# EAGLE design FaBo_KeyBoard_Sample_cursor_Rev100000 (EAGLE 9.6.2)
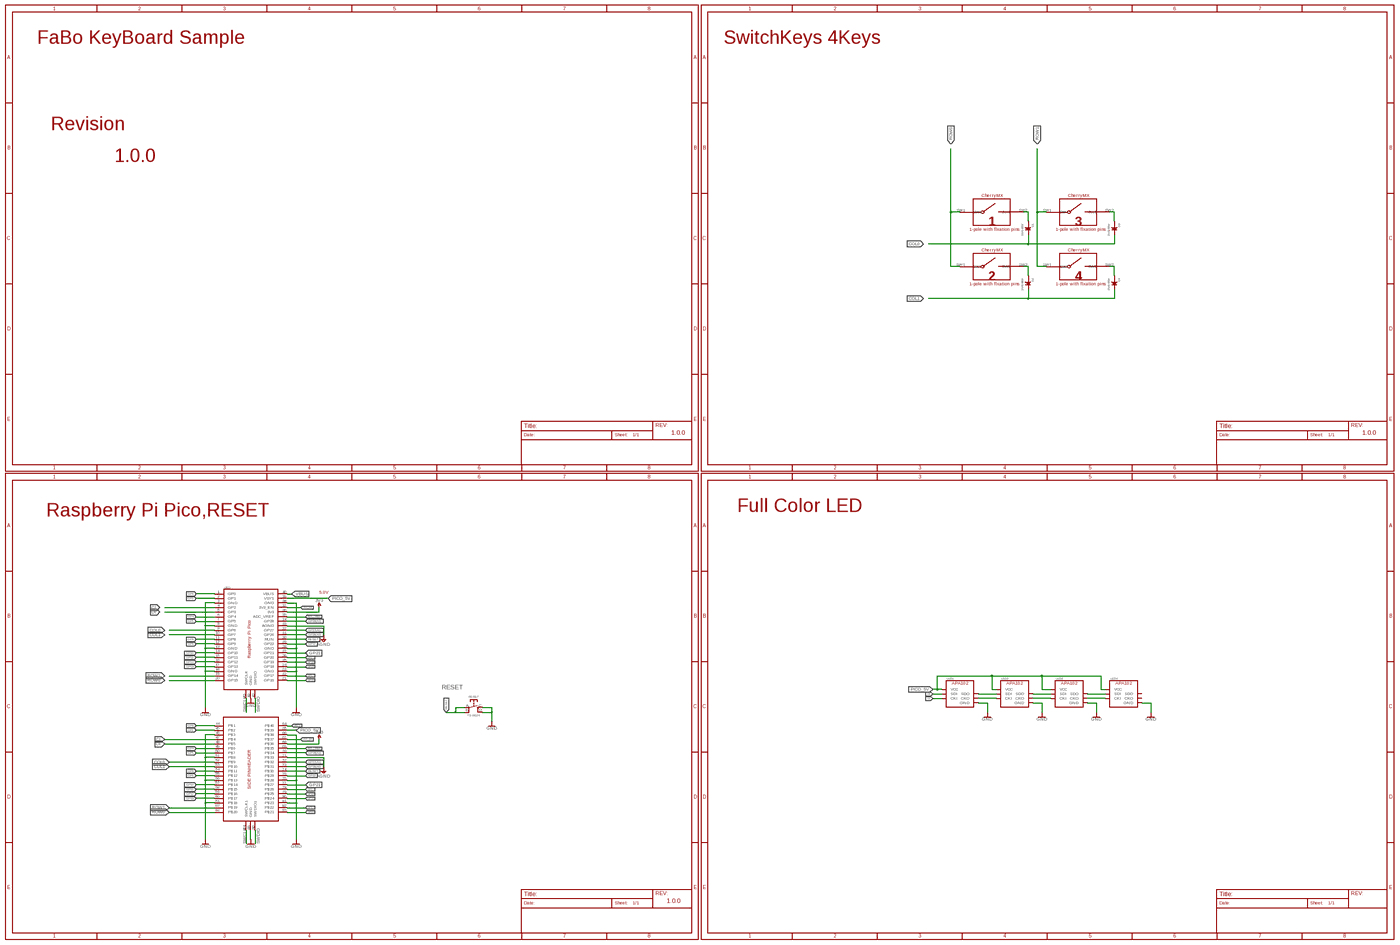
[diagram p0: schematic, sheet 1, overview]
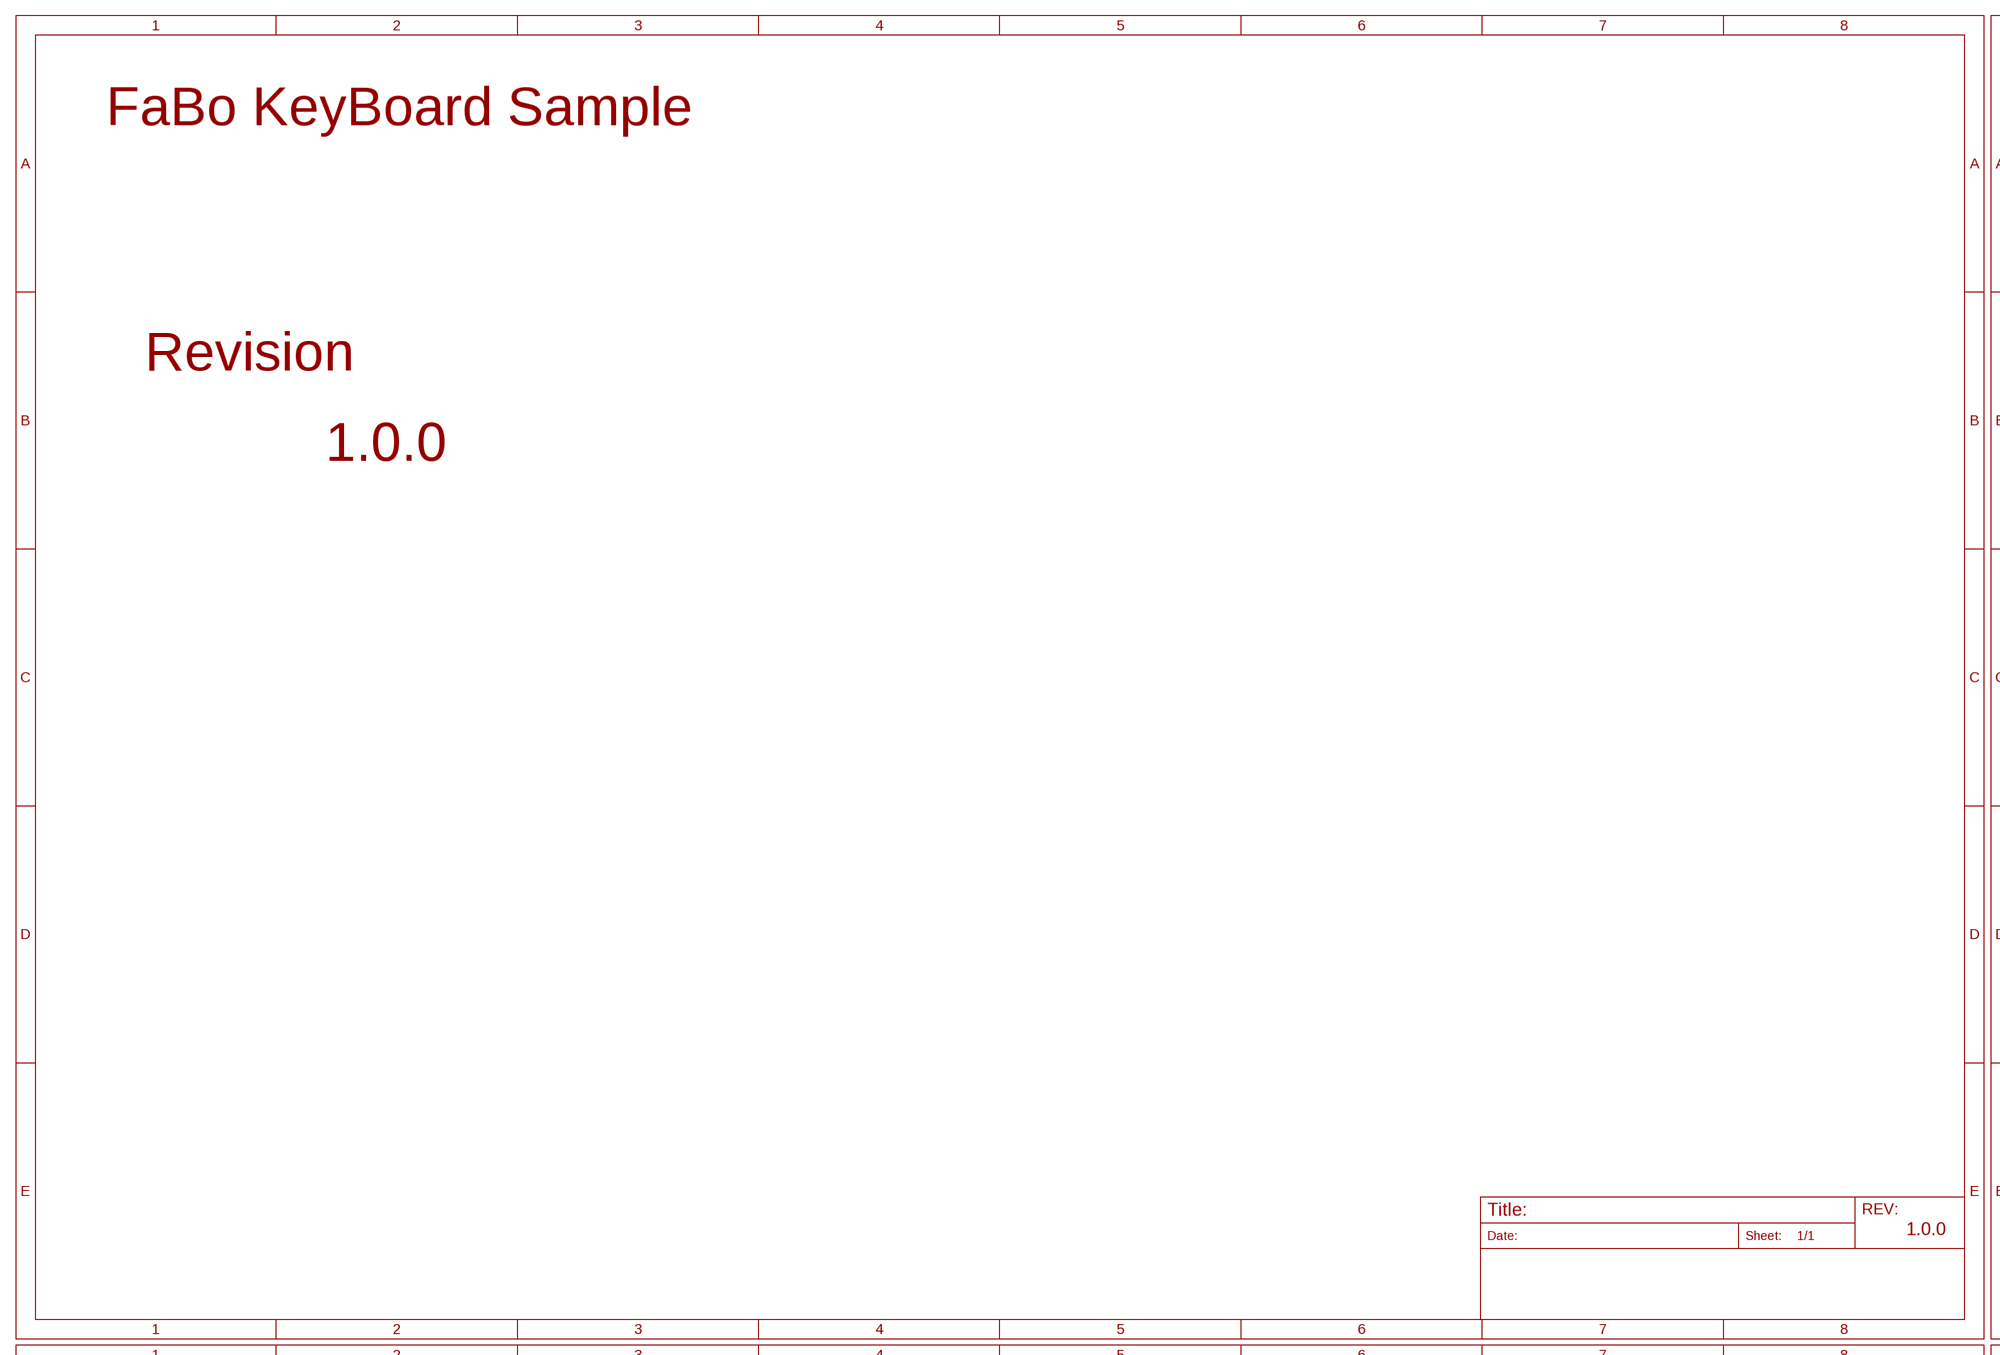
[diagram p1: schematic, sheet 1, part 1 of 4]
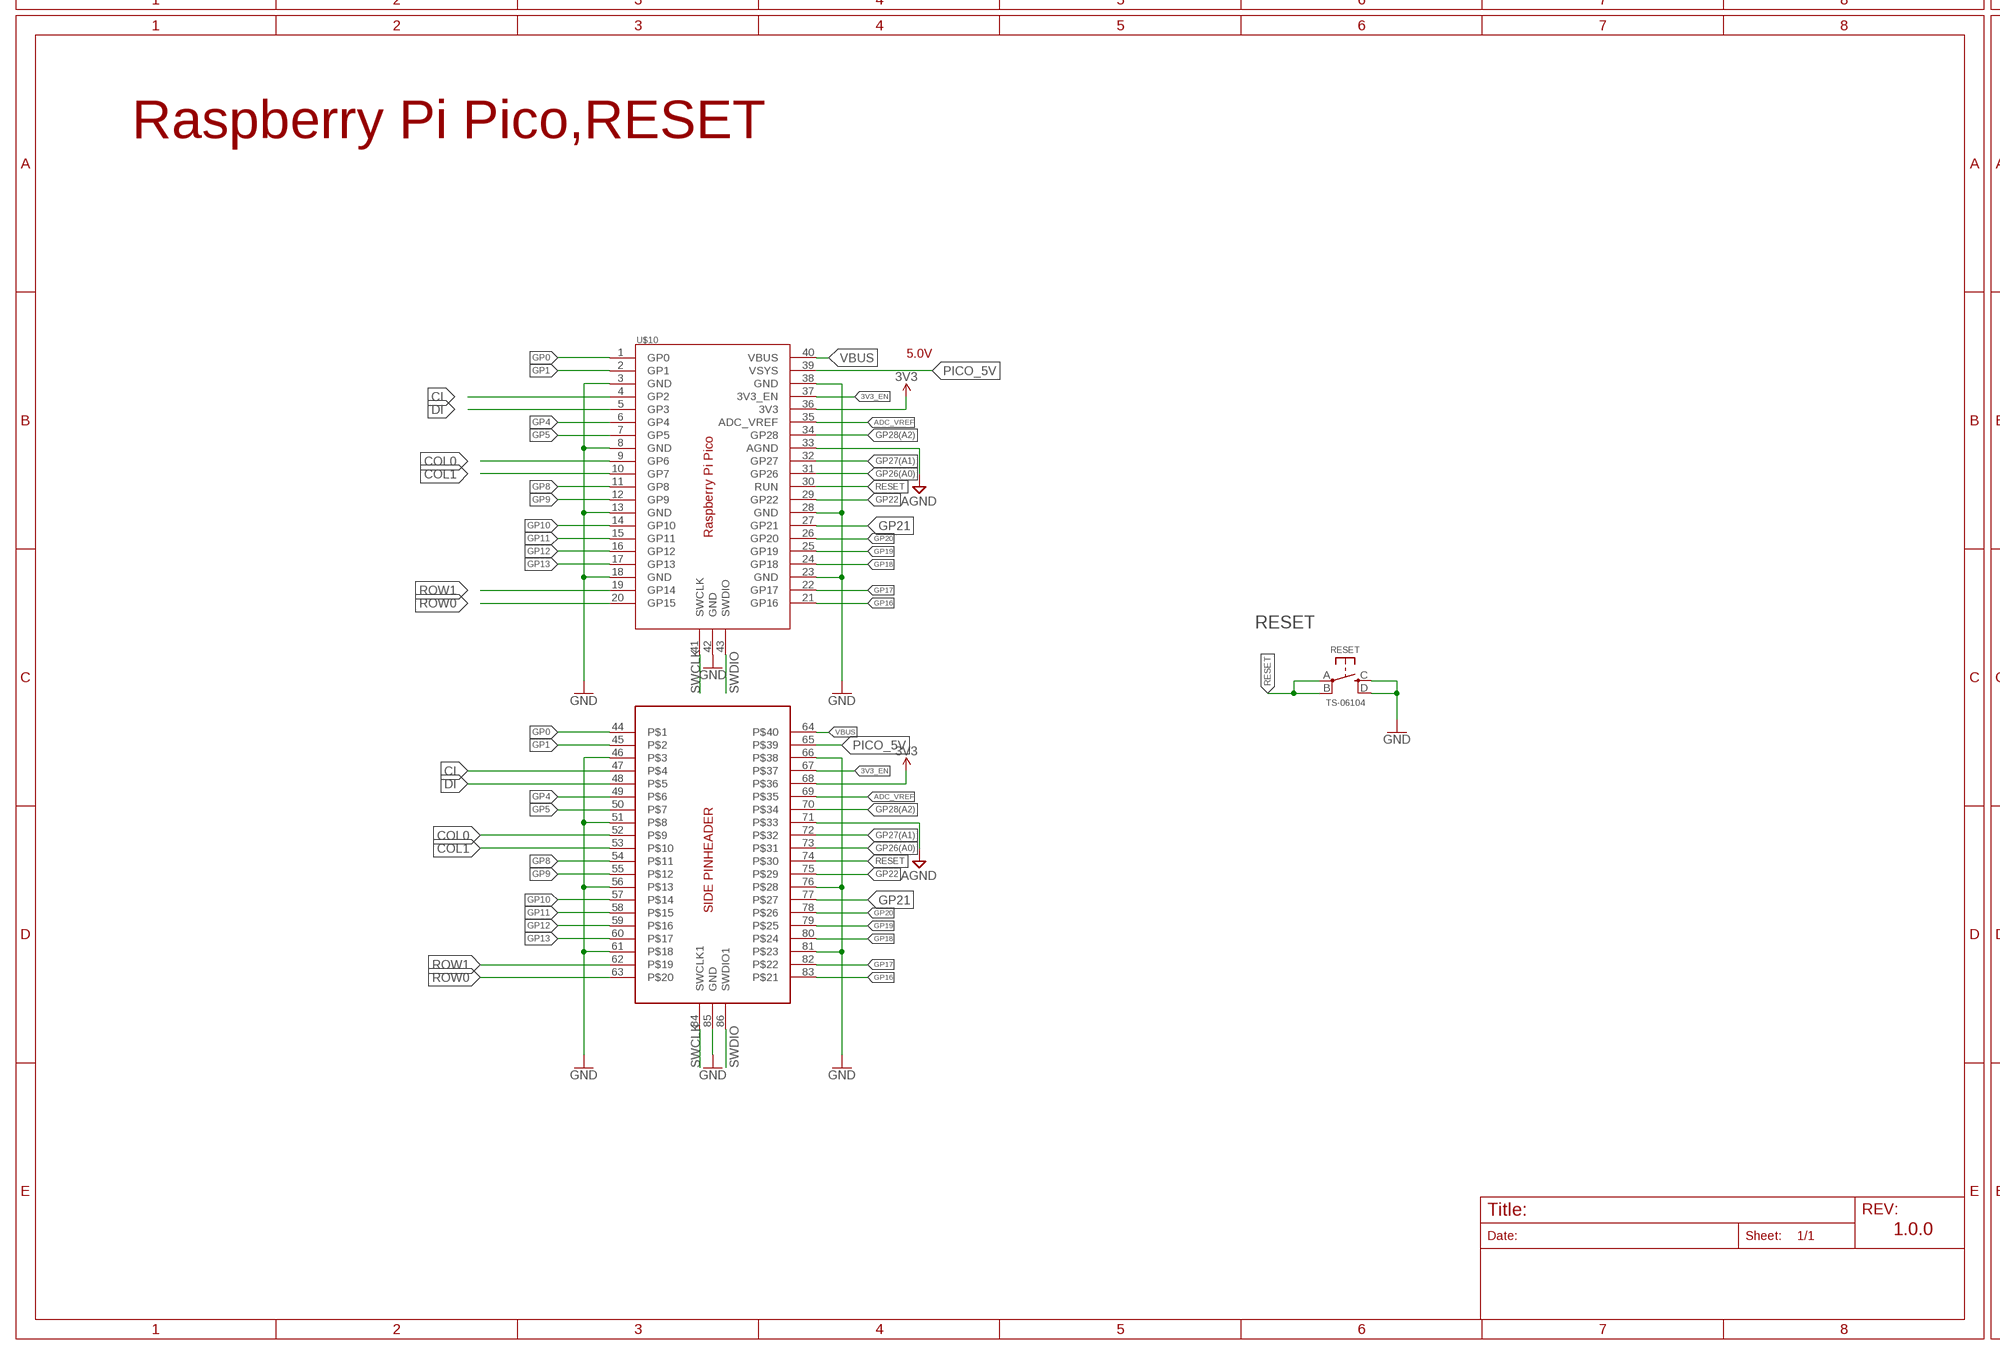
[diagram p2: schematic, sheet 1, part 2 of 4]
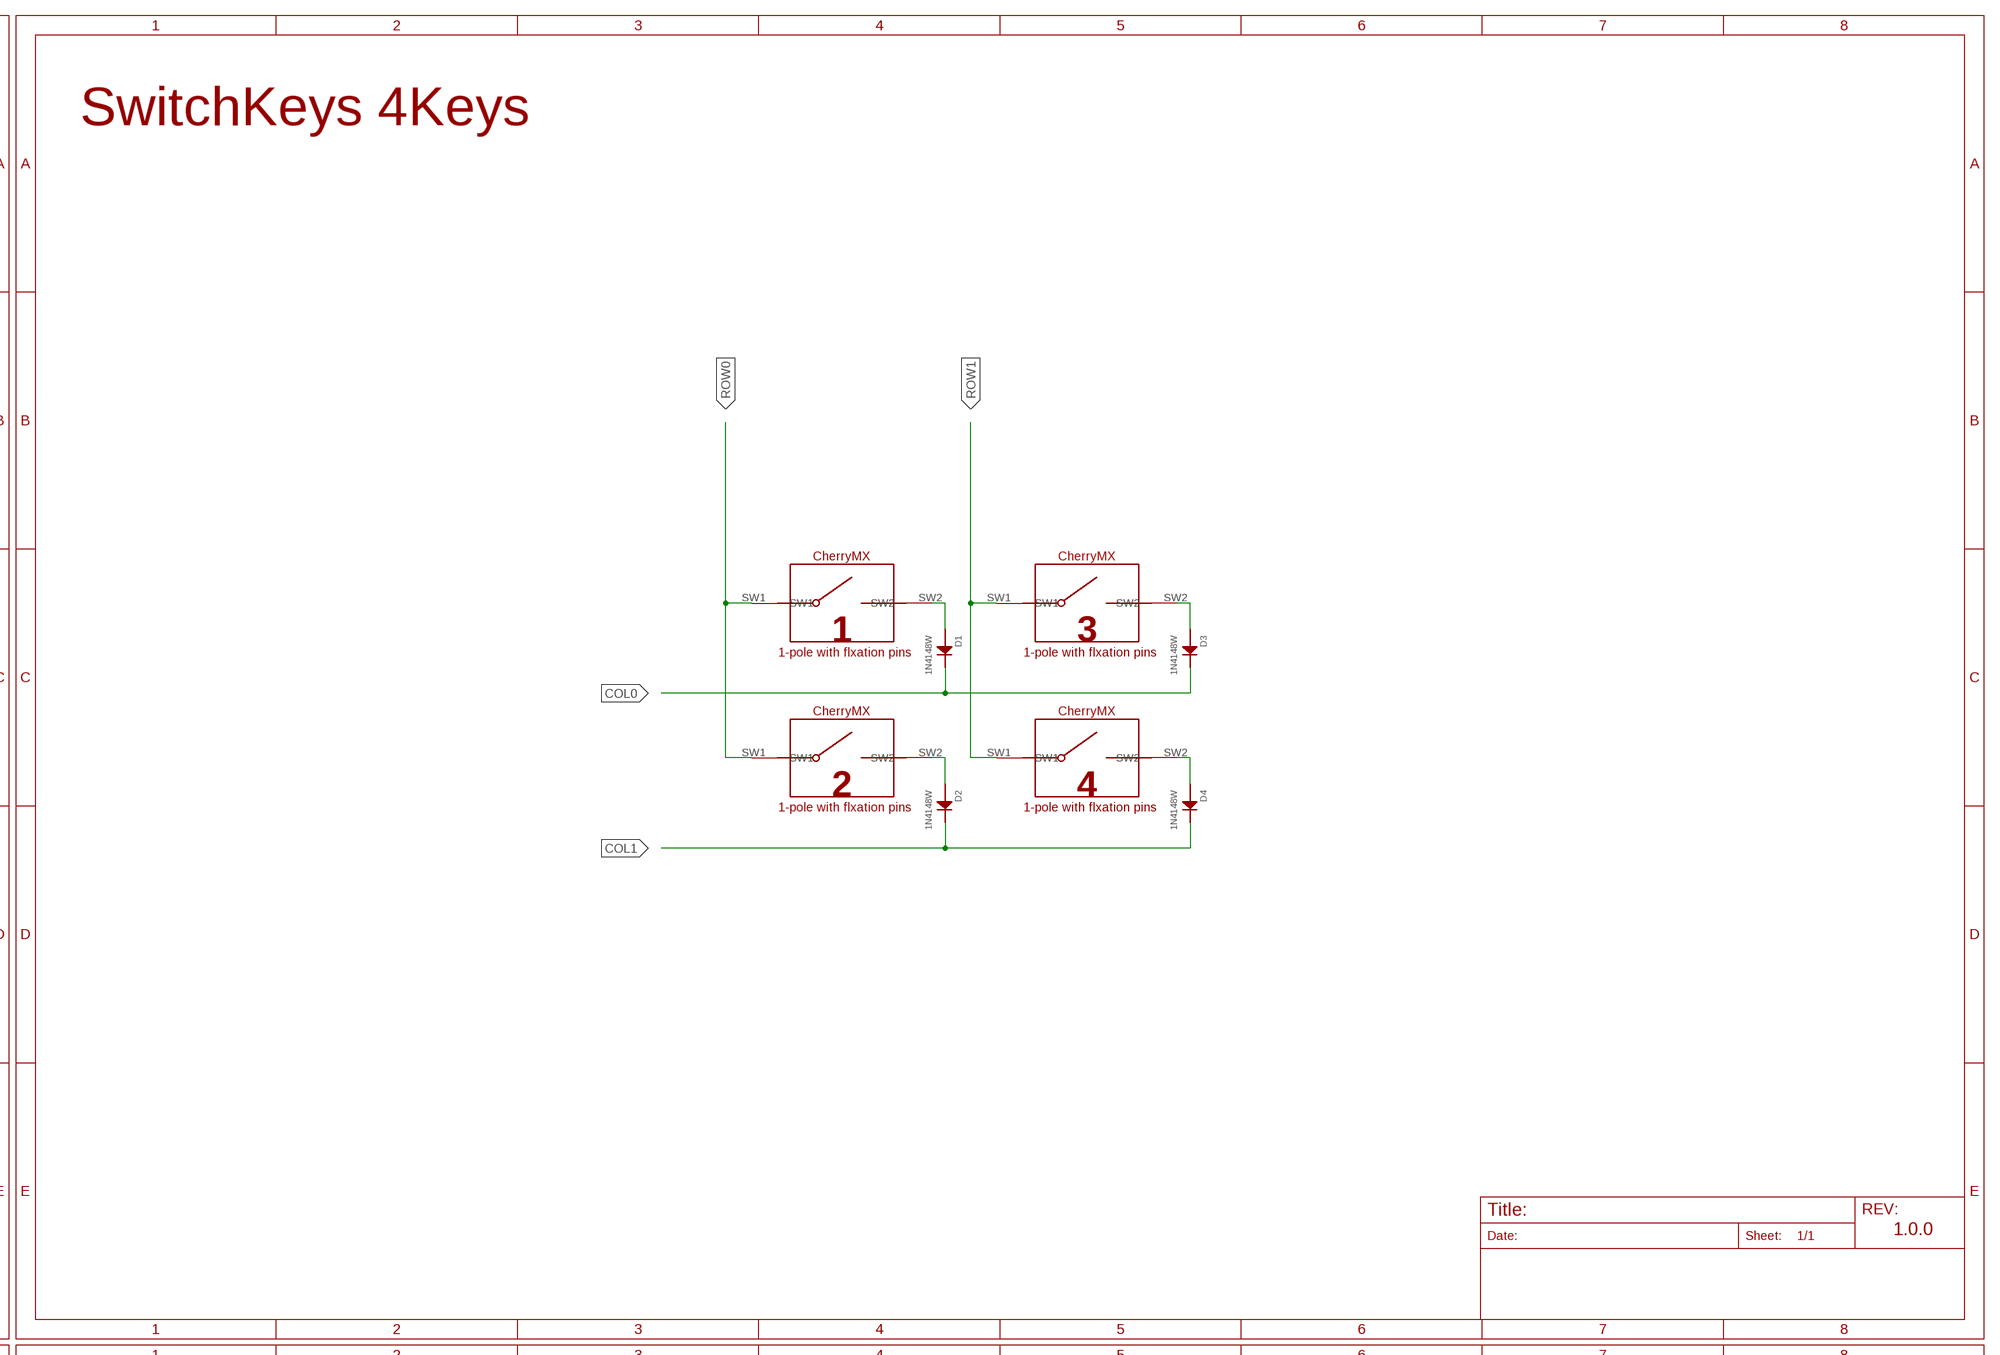
[diagram p3: schematic, sheet 1, part 3 of 4]
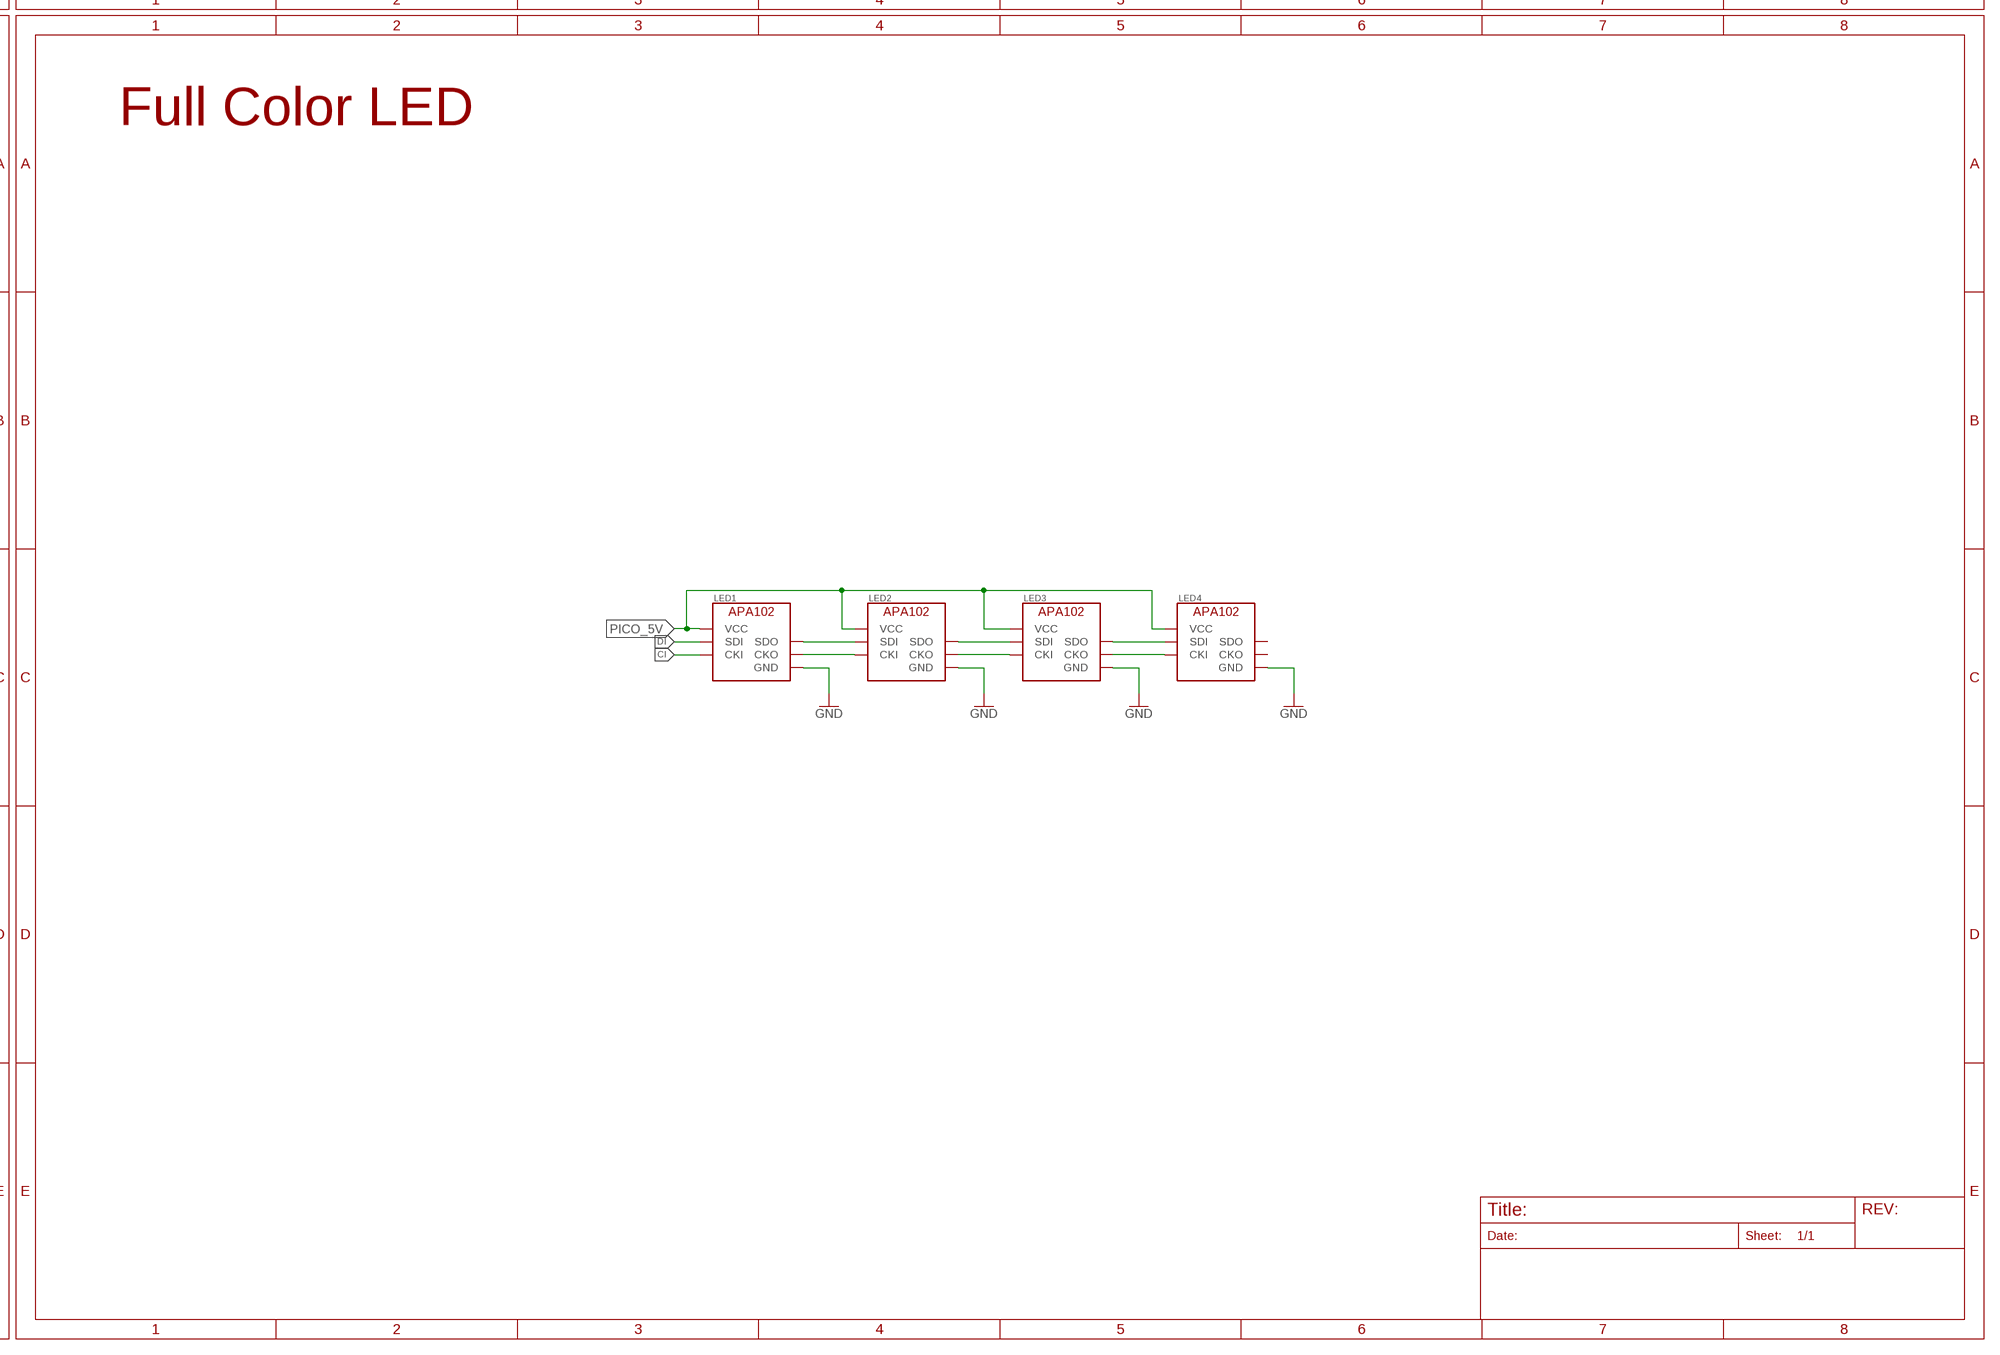
[diagram p4: schematic, sheet 1, part 4 of 4]

## Parts
D1  1N4148W  [SOD-123]
D2  1N4148W  [SOD-123]
D3  1N4148W  [SOD-123]
D4  1N4148W  [SOD-123]
LED1  APA102_IPIXEL  [APA102_2020]
LED2  APA102_IPIXEL  [APA102_2020]
LED3  APA102_IPIXEL  [APA102_2020]
LED4  APA102_IPIXEL  [APA102_2020]
RESET  TS-06104  [TS-06104]
SW1  CHERRYMX_1-POLE_FLXATION_PINS  [CHERRYMX_1-POLE_FLXATION_PINS]
SW2  CHERRYMX_1-POLE_FLXATION_PINS  [CHERRYMX_1-POLE_FLXATION_PINS]
SW3  CHERRYMX_1-POLE_FLXATION_PINS  [CHERRYMX_1-POLE_FLXATION_PINS]
SW4  CHERRYMX_1-POLE_FLXATION_PINS  [CHERRYMX_1-POLE_FLXATION_PINS]
U$10  RASPBERRY_PI_PICO_BOTH_TH_PINHEADER  [RASPBERRY_PI_PICO_HEADER_BOTH]

## Nets
3V3: U$10.36(3V3) U$10.68
3V3_EN: U$10.37(3V3_EN) U$10.67
ADC_VREF: U$10.35(ADC_VREF) U$10.69
AGND: U$10.33(AGND) U$10.71
CI: LED1.CKI U$10.4(GP2) U$10.47
CI1: LED1.CKO LED2.CKI
CI2: LED2.CKO LED3.CKI
CI3: LED3.CKO LED4.CKI
COL0: D1.1(CATHODE) D3.1(CATHODE) U$10.9(GP6) U$10.52
COL1: D2.1(CATHODE) D4.1(CATHODE) U$10.10(GP7) U$10.53
DI: LED1.SDI U$10.5(GP3) U$10.48
DI1: LED1.SDO LED2.SDI
DI2: LED2.SDO LED3.SDI
DI3: LED3.SDO LED4.SDI
GND: LED1.GND LED2.GND LED3.GND LED4.GND RESET.C RESET.D U$10.3(GND) U$10.8(GND) U$10.13(GND) U$10.18(GND) U$10.23(GND) U$10.28(GND) U$10.38(GND) U$10.42(GND) U$10.46 U$10.51 U$10.56 U$10.61 U$10.66 U$10.76 U$10.81 U$10.85(GND)
GP0: U$10.1(GP0) U$10.44
GP1: U$10.2(GP1) U$10.45
GP4: U$10.6(GP4) U$10.49
GP5: U$10.7(GP5) U$10.50
GP8: U$10.11(GP8) U$10.54
GP9: U$10.12(GP9) U$10.55
GP10: U$10.14(GP10) U$10.57
GP11: U$10.15(GP11) U$10.58
GP12: U$10.16(GP12) U$10.59
GP13: U$10.17(GP13) U$10.60
GP16: U$10.21(GP16) U$10.83
GP17: U$10.22(GP17) U$10.82
GP18: U$10.24(GP18) U$10.80
GP19: U$10.25(GP19) U$10.79
GP20: U$10.26(GP20) U$10.78
GP21: U$10.27(GP21) U$10.77
GP22: U$10.29(GP22) U$10.75
GP26(A0): U$10.31(GP26) U$10.73
GP27(A1): U$10.32(GP27) U$10.72
GP28(A2): U$10.34(GP28) U$10.70
N$2: D1.2(ANODE) SW1.SW2
N$3: D2.2(ANODE) SW2.SW2
N$8: D3.2(ANODE) SW3.SW2
N$9: D4.2(ANODE) SW4.SW2
PICO_5V: LED1.VCC LED2.VCC LED3.VCC LED4.VCC U$10.39(VSYS) U$10.65
RESET: RESET.A RESET.B U$10.30(RUN) U$10.74
ROW0: SW1.SW1 SW2.SW1 U$10.20(GP15) U$10.63
ROW1: SW3.SW1 SW4.SW1 U$10.19(GP14) U$10.62
SWCLK: U$10.41(SWCLK) U$10.84(SWCLK1)
SWDIO: U$10.43(SWDIO) U$10.86(SWDIO1)
VBUS: U$10.40(VBUS) U$10.64
Unconnected: LED4.CKO LED4.SDO

## Notes on the sheet
- FaBo KeyBoard Sample | SwitchKeys 4Keys
- Revision
- 1.0.0
- 1 | 3
- 2 | 4
- 1.0.0 | 1.0.0
- Raspberry Pi Pico,RESET | Full Color LED
- 5.0V
- RESET
- 1.0.0

## Library data of the parts
D1-D4 = FaBo-Diode:1N4148W
LED1-LED4 = FaBo-LED:APA102
RESET = FaBo-Switch:TS-06104
SW1-SW4 = FaBo-Keyboard:CHERRYMX_1-POLE_FLXATION_PINS: KeySwitch MX Series
U$10 = FaBo-Boards:RASPBERRY_PI_PICO_BOTH_TH_PINHEADER

## Board
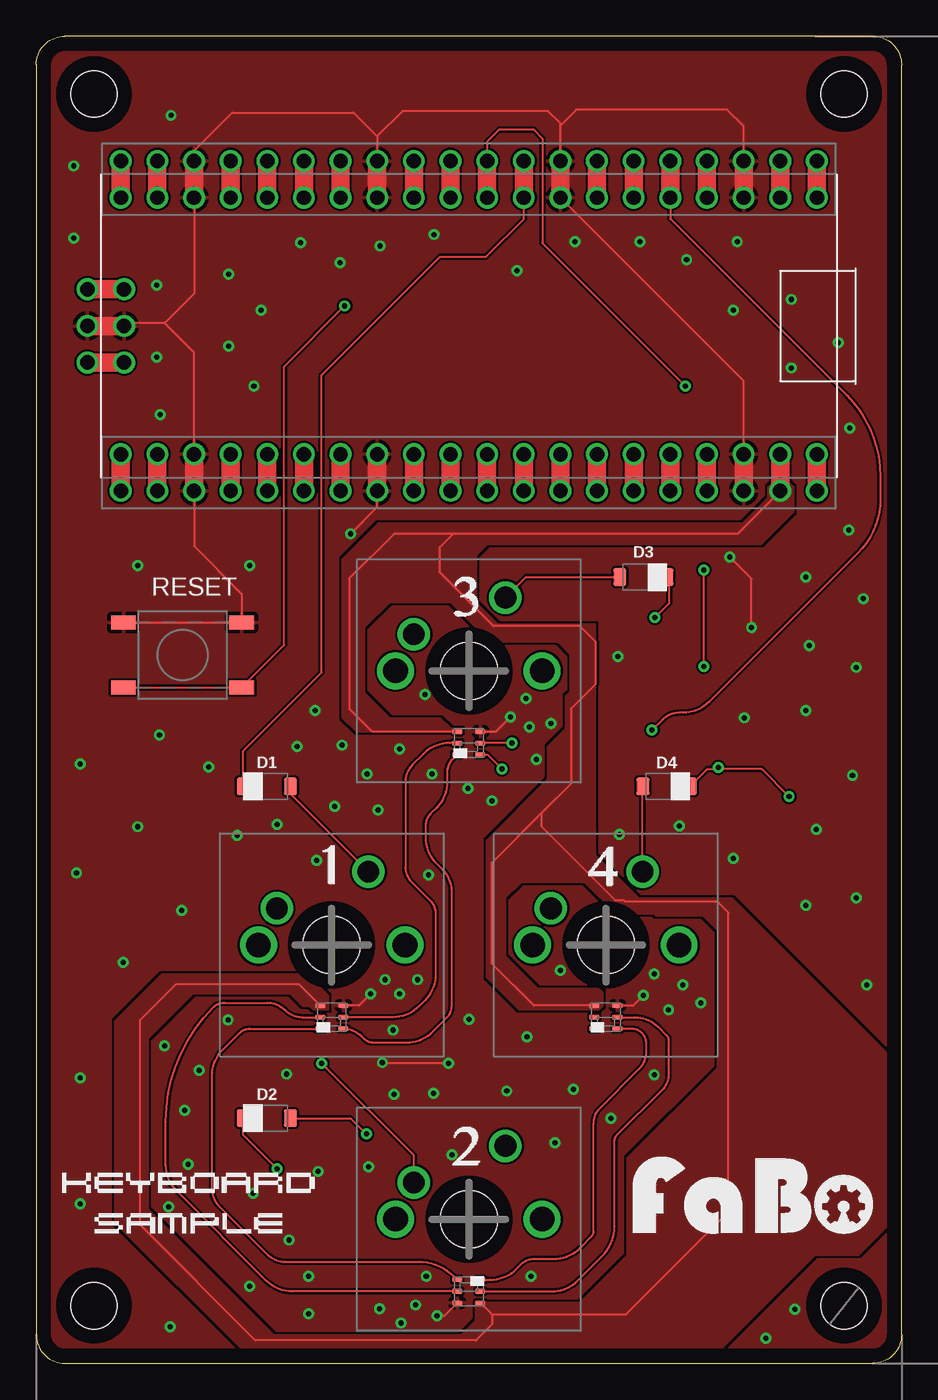
[diagram p5: board, top side]
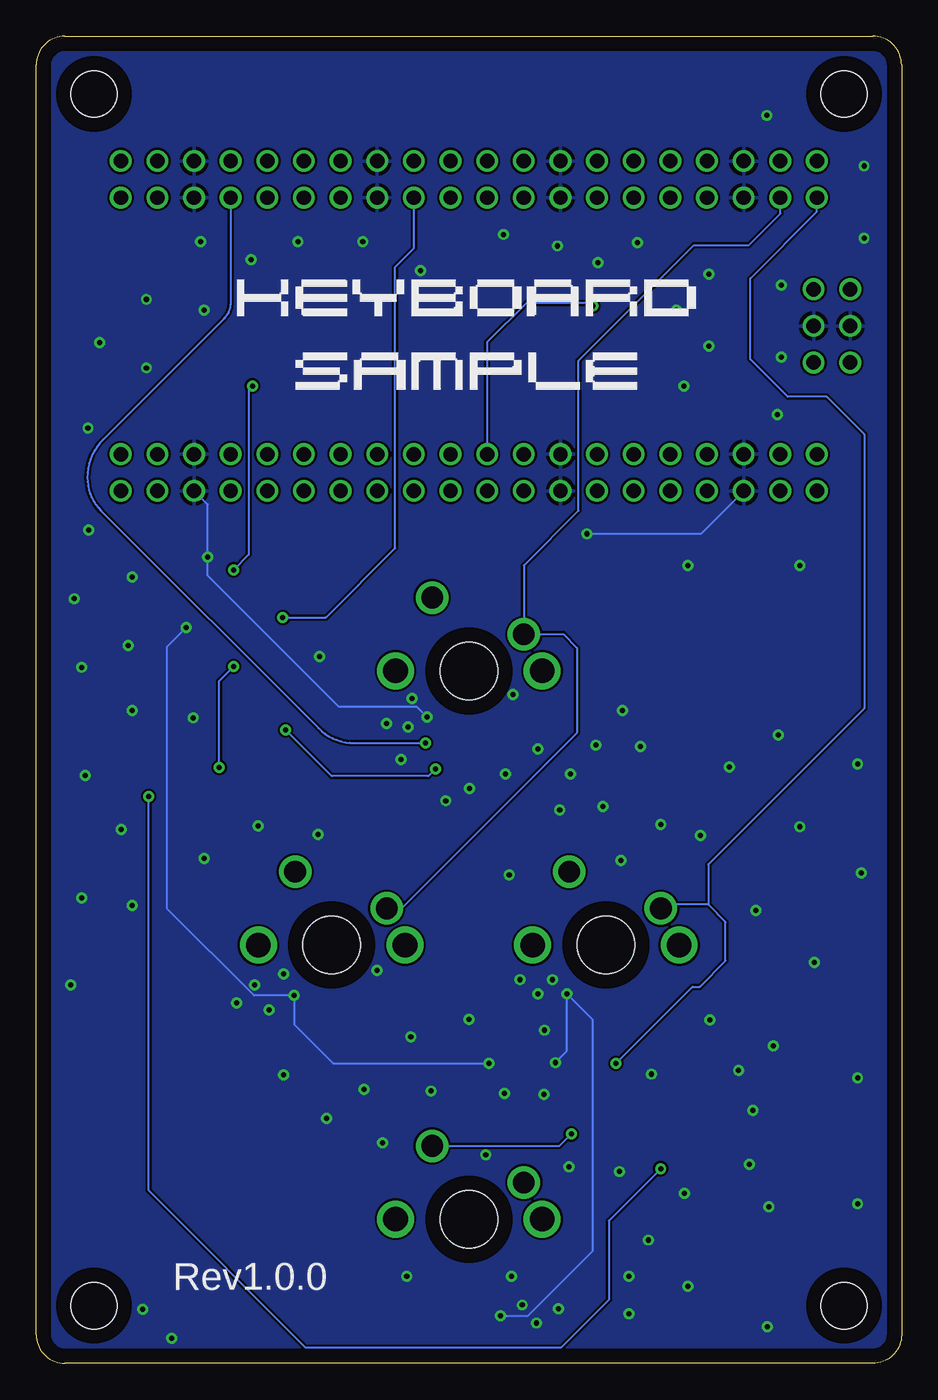
[diagram p6: board, bottom side, seen from below]

Size 60 x 92 mm. Coordinates in mm from the lower left corner, seen from the top.
Outline: 2,0 58,0 arc90 60,2 60,90 arc90 58,92 2,92 arc90 0,90 0,2 arc90 2,0
Copper layers (1*16): Top 0.035mm / dielectric 1.5mm / Bottom 0.035mm
Design rules "default *": minimum track width 6mil, minimum drill 0.35mm, track to track 6mil, track to pad 6mil, pad to pad 6mil, via to via 6mil, smd to smd 6mil, copper to edge 40mil, drill to drill 6mil, minimum pad ring 10mil, minimum via ring 8mil, stop-mask expansion 4mil, vias tented up to drill 0.4mm, thermal gap 10mil
Holes 3.2 mm at 4,4 56,4 4,88 56,88

### Footprints (pad centres in the part's own frame; a part is rotated, then mirrored left to right if it is on the bottom)
SOD-123 = smd 0.91 x 1.22: 1 -1.635,0; 2 1.635,0
APA102_2020 = smd 0.7 x 0.35: CKI 0.8,0; CKO -0.8,0; GND 0.8,0.8; SDI 0.8,-0.8; SDO -0.8,-0.8; VCC -0.8,0.8
TS-06104 = smd 1.8 x 1: A 4.1,2.25; B -4.1,2.25; C 4.1,-2.25; D -4.1,-2.25
CHERRYMX_1-POLE_FLXATION_PINS = drill 1.704: FLXA1 -5.08,0; FLXA2 5.08,0 | drill 1.501: SW1 -3.81,2.54; SW2 2.54,5.08 | hole 3.99: 0,0
RASPBERRY_PI_PICO_HEADER_BOTH = drill 1: 1 -8.89,24.13; 2 -8.89,21.59; 3 -8.89,19.05; 4 -8.89,16.51; 5 -8.89,13.97; 6 -8.89,11.43; 7 -8.89,8.89; 8 -8.89,6.35; 9 -8.89,3.81; 10 -8.89,1.27; 11 -8.89,-1.27; 12 -8.89,-3.81; 13 -8.89,-6.35; 14 -8.89,-8.89; 15 -8.89,-11.43; 16 -8.89,-13.97; 17 -8.89,-16.51; 18 -8.89,-19.05; 19 -8.89,-21.59; 20 -8.89,-24.13; 21 8.89,-24.13; 22 8.89,-21.59; 23 8.89,-19.05; 24 8.89,-16.51; 25 8.89,-13.97; 26 8.89,-11.43; 27 8.89,-8.89; 28 8.89,-6.35; 29 8.89,-3.81; 30 8.89,-1.27; 31 8.89,1.27; 32 8.89,3.81; 33 8.89,6.35; 34 8.89,8.89; 35 8.89,11.43; 36 8.89,13.97; 37 8.89,16.51; 38 8.89,19.05; 39 8.89,21.59; 40 8.89,24.13; 41 -2.54,-23.9; 42 0,-23.9; 43 2.54,-23.9; 44 -11.43,24.13; 45 -11.43,21.59; 46 -11.43,19.05; 47 -11.43,16.51; 48 -11.43,13.97; 49 -11.43,11.43; 50 -11.43,8.89; 51 -11.43,6.35; 52 -11.43,3.81; 53 -11.43,1.27; 54 -11.43,-1.27; 55 -11.43,-3.81; 56 -11.43,-6.35; 57 -11.43,-8.89; 58 -11.43,-11.43; 59 -11.43,-13.97; 60 -11.43,-16.51; 61 -11.43,-19.05; 62 -11.43,-21.59; 63 -11.43,-24.13; 64 11.43,24.13; 65 11.43,21.59; 66 11.43,19.05; 67 11.43,16.51; 68 11.43,13.97; 69 11.43,11.43; 70 11.43,8.89; 71 11.43,6.35; 72 11.43,3.81; 73 11.43,1.27; 74 11.43,-1.27; 75 11.43,-3.81; 76 11.43,-6.35; 77 11.43,-8.89; 78 11.43,-11.43; 79 11.43,-13.97; 80 11.43,-16.51; 81 11.43,-19.05; 82 11.43,-21.59; 83 11.43,-24.13; 84 -2.54,-26.44; 85 0,-26.44; 86 2.54,-26.44

### Placement (x,y rotation side)
D1  16,40 0 top
D2  16,17 0 top
D3  42.1,54.5 180 top
D4  43.7,40 180 top
LED1  30,43 0 top
LED2  20.5,24 0 top
LED3  30,5 180 top
LED4  39.5,24 0 top
RESET  10.16,49.1 180 top
SW1  20.5,29 0 top
SW2  30,10 0 top
SW3  30,48 0 top
SW4  39.5,29 0 top
U$1  [LOGO_FABO_L]  49,9 0 top
U$10  30,71.91 270 top

### Tracks (layer width: path | path; a pad name or v marks a point on that pad's centre or on a via)
3V3
  Top 1.27: U$10.68 U$10.36
3V3_EN
  Top 1.27: U$10.67 U$10.37
ADC_VREF
  Top 1.27: U$10.69 U$10.35
AGND
  Top 1.27: U$10.71 U$10.33
CI  (via drill 0.35)
  Top 0.152: v33,43 LED1.CKI
  Top 1.27: U$10.4 U$10.47
  Bottom 0.152: U$10.4 46.51,73.54 arc45 46.97,72.43 55.36,64.04 arc-45 56.45,61.4 arc-45 55.49,59.09 40.43,44.03 arc-45 37.95,43 v33,43
CI1
  Top 0.152: LED1.CKO 28.65,43 arc45 26.86,42.26 26.1,41.5 arc45 25.6,40.29 25.6,34.4 arc45 26.02,33.38 27.3,32.1 arc-45 27.7,31.13 27.7,26.95 arc-45 26.96,25.16 26.54,24.74 arc-45 24.75,24 LED2.CKI
CI2
  Top 0.152: LED3.CKI 17.75,5 arc-45 15.96,5.74 9.74,11.96 arc-45 9,13.75 9,16.77 arc-45 12.28,24.68 arc-45 13.05,25 16.04,25 arc-45 17.25,24.5 arc45 18.46,24 LED2.CKO
CI3
  Top 0.152: LED3.CKO 35.75,5 arc45 37.54,5.74 39.26,7.46 arc45 40.1,9.49 40.1,15.49 arc-45 40.21,15.76 43.39,18.94 arc45 43.85,20.05 43.85,22.4 arc45 43.71,22.74 43.13,23.32 arc45 41.49,24 LED4.CKI
COL0  (via drill 0.35)
  Top 0.152: U$10.9 33.81,79.31 31.2,76.7 28,76.7 19.8,68.5 19.8,47.9 14.37,42.47 D1.1 | v42.9,51.7 43.89,52.69 43.89,54.34 D3.1
  Top 1.27: U$10.9 U$10.52
  Bottom 0.152: v42.9,51.7 39.9,51.7 35.1,56.5 35.1,76 33.81,77.29 U$10.9
COL1  (via drill 0.35)
  Top 0.152: U$10.53 31.27,84.67 32.1,85.5 34.5,85.5 35.1,84.9 35.1,77.65 v45,67.75 | v47.3,41.3 47.3,41.2 | v52.2,39.3 50.3,41.2 47.3,41.2 | v46.3,48.3 v46.3,55 | D4.1 46.53,41.2 47.3,41.2 | D2.1 14.37,15.84 v16.7,13.5
  Top 1.27: U$10.10 U$10.53
  Bottom 0.152: v47.3,41.3 47.3,47.3 v46.3,48.3 | v45,67.75 45.25,67.5 45.25,56.05 v46.3,55 | v16.7,13.5 20.3,9.9 20.3,4.4 23.6,1.1 41.3,1.1 52.2,12 v52.2,39.3
DI  (via drill 0.35)
  Top 0.152: U$10.5 43.97,79.33 56.2,67.1 arc-45 58.53,61.47 58.53,59.95 arc-45 56.96,56.16 46.64,45.84 arc-45 44.85,45.1 44.6,45.1 arc45 43.41,44.6 v42.7,43.9 | LED1.SDI 31.3,42.2 v32.3,41.2
  Top 1.27: U$10.5 U$10.48
  Bottom 0.152: v32.3,41.2 32.8,40.7 39.5,40.7 v42.7,43.9
DI1
  Top 0.152: LED2.SDI arc-45 22.58,22.67 22.75,22.5 arc45 23.35,22.25 25.7,22.25 arc45 27.49,22.99 28.5,24 arc45 28.8,24.72 28.8,32.75 arc45 28.2,34.2 27.74,34.66 arc-45 27,36.45 27,37.25 arc-45 27.35,38.1 27.76,38.51 arc45 28.5,40.3 28.5,41 arc-45 28.85,41.85 LED1.SDO
DI2
  Top 0.152: LED2.SDO 14.82,23.2 arc45 14.1,22.9 12.94,21.74 arc45 12.2,19.95 12.2,12.05 arc45 12.66,10.94 16.06,7.54 arc45 17.25,7.05 26.54,7.05 arc-45 28.94,6.06 LED3.SDI
DI3
  Top 0.152: LED4.SDI 41.28,23.2 arc-45 42,22.9 arc-45 42.3,22.18 42.3,21.6 arc-45 41.8,20.41 39.09,17.7 arc45 38.65,16.62 38.65,9.16 arc-45 38.5,8.8 37.69,7.99 arc-45 35.9,7.25 34.5,7.25 arc45 33.65,6.9 33.29,6.54 arc-45 31.5,5.8 LED3.SDO
GND  (via drill 0.35)
  Top 0.152: RESET.C RESET.D 14.26,53.34 10.95,56.65 U$10.81 | U$10.23 10.95,70.05 8.9,72.1 | 8.9,72.1 6.29,72.1 U$10.42 | U$10.18 10.95,74.15 8.9,72.1 | U$10.61 10.95,84.05 13.6,86.7 22,86.7 23.65,85.05 | 23.65,85.05 U$10.56 | U$10.51 36.35,85.8 | 36.35,85.8 36.35,85.95 35.5,86.8 25.4,86.8 23.65,85.05 | U$10.46 49.05,85.75 47.9,86.9 37.45,86.9 36.35,85.8 | U$10.38 49.05,68.1 U$10.8 | LED3.GND 28.3,3.3 v27.8,3.3 | v23.2,25.6 22.4,24.8 LED2.GND | LED4.GND 41.4,24.8 v42.1,25.5 | v49.6,51 49.6,54.4 v48.1,55.9 | v28.6,20.8 24.05,20.8 v24,20.85 | v21.8,57.5 23.65,59.35 U$10.76 | LED1.GND 31.9,43.8 v32.9,44.8
  Top 1.27: U$10.3 U$10.46 | U$10.8 U$10.51 | U$10.13 U$10.56 | U$10.18 U$10.61 | U$10.66 U$10.38 | U$10.76 U$10.28 | U$10.81 U$10.23 | U$10.42 U$10.85
  Bottom 0.152: v27.8,3.3 25.9,3.3 21.4,7.8 21.4,23.8 v23.2,25.6 23.2,21.65 v24,20.85 | v49.6,51 50.9,49.7 50.9,31.5 44.9,25.5 v42.1,25.5 42.1,23.5 39.4,20.8 v28.6,20.8 | U$10.66 48.1,59.53 v48.1,55.9 48.1,54.6 39,45.5 33.6,45.5 v32.9,44.8 | U$10.81 13.93,57.5 v21.8,57.5
  other vias: 26.3,4.05 25.3,2.8 23.8,3.8 24.2,26.6 25.2,25.6 26.45,26.6 42.85,27 43.85,24.5 44.85,26.25 46.1,25 27.05,6.05 34.3,6.05 18.9,6.05 17.55,8.55 15.05,11.8 19.55,13.3 42.85,20 39.85,17 11.3,20.3 13.3,23.8 10.3,17.55 10.55,13.8 34.7,41.85 35.7,44.35 33.95,46.1 34.2,44.1 24.75,23.1 30,23.85 26.95,46.35 25.2,42.6 27.45,40.85 29.95,39.85 56.35,57.75 56.4,64.84 52.35,69 48.35,73 45.1,76.5 41.85,77.75 48.6,77.75 52.35,73.75 55.6,70.75 21.2,42.85 22.95,40.85 23.7,38.35 27.2,33.85 20.7,38.6 19.45,34.85 16.7,37.35 13.95,36.6 11.95,41.35 40.35,49 53.35,54.5 57.35,53 53.6,49.75 49.1,44.75 53.35,45.25 56.85,48.25 52.6,3.75 50.6,1.75 36.35,27.25 31.6,39 18.1,42.75 19.35,45.25 9.3,2.55 3.05,11.05 6.05,27.8 2.8,34 3.05,19.8 7.05,37.2 3.05,41.55 8.55,43.55 7.05,55.3 14.8,55.3 56.6,40.75 54.1,37 56.85,32.25 57.6,26.25 53.35,31.75 48.35,35 44.6,37.25 40.45,36.65 37.35,77.75 33.35,75.75 27.6,78.25 13.35,75.5 15.6,73 13.35,70.5 15.1,67.75 8.6,65.75 8.35,69.75 8.35,74.75 2.6,78 2.6,83 9.35,86.5 34.02,22.62 32.63,18.88 37.26,18.99 35.98,15.3 23.05,13.63 17.35,20.05 18.32,77.68 23.86,77.46 21.06,76.28 24.8,18.65 27.54,18.71 28.83,14.46 18.9,3.45 14.8,5.35 9.2,10.85 8.9,22 10.1,31.4
  pour Top (rank 6): -2.75,94 64.4,94 64.4,-8.5 -2.75,-8.5
  pour Bottom (rank 6): -1.25,93 63.63,93 63.63,-7 -1.25,-7
GP0
  Top 1.27: U$10.1 U$10.44
GP1
  Top 1.27: U$10.2 U$10.45
GP4
  Top 1.27: U$10.6 U$10.49
GP5
  Top 1.27: U$10.7 U$10.50
GP8
  Top 1.27: U$10.11 U$10.54
GP9
  Top 1.27: U$10.12 U$10.55
GP10
  Top 1.27: U$10.14 U$10.57
GP11
  Top 1.27: U$10.15 U$10.58
GP12
  Top 1.27: U$10.16 U$10.59
GP13
  Top 1.27: U$10.17 U$10.60
GP16
  Top 1.27: U$10.83 U$10.21
GP17
  Top 1.27: U$10.82 U$10.22
GP18
  Top 1.27: U$10.80 U$10.24
GP19
  Top 1.27: U$10.79 U$10.25
GP20
  Top 1.27: U$10.78 U$10.26
GP21
  Top 1.27: U$10.77 U$10.27
GP22
  Top 1.27: U$10.75 U$10.29
GP26(A0)
  Top 1.27: U$10.73 U$10.31
GP27(A1)
  Top 1.27: U$10.72 U$10.32
GP28(A2)
  Top 1.27: U$10.70 U$10.34
N$2
  Top 0.152: D1.2 17.64,39.48 SW1.SW2
N$3  (via drill 0.35)
  Top 0.152: v22.9,15.9 22.3,16.5 22.23,16.57 21.8,17 D2.2
  Bottom 0.152: SW2.SW2 23.72,15.08 v22.9,15.9
N$8
  Top 0.152: SW3.SW2 33.96,54.5 D3.2
N$9
  Top 0.152: SW4.SW2 42.04,39.98 D4.2
PICO_5V
  Top 0.152: U$10.65 48.61,57.5 28.9,57.5 | LED1.VCC 23.3,43.8 21.7,45.4 21.7,54.4 24.8,57.5 28.9,57.5 | LED4.VCC 34.5,24.8 31.6,27.7 31.6,34.7 35.08,38.17 | 35.08,38.17 37.1,40.2 37.1,45.4 38.8,47.1 38.8,50 37.7,51.1 31.7,51.1 28,54.8 28,56.6 28.9,57.5 | LED3.VCC 31.6,3.4 | 31.6,3.4 31.6,2.7 30.5,1.6 15.2,1.6 7.2,9.6 7.2,23.8 9.7,26.3 18.2,26.3 LED2.VCC | 31.6,3.4 40.9,3.4 48,10.5 48,31.25 47.25,32 40.87,32 40.78,32.09 40.16,32.09 35.08,37.17 35.08,38.17
  Top 1.27: U$10.65 U$10.39
  pour Top (no thermals): 51.25,61.25 52,61.25 52.5,60.75 52.5,59 50.25,56.75 31.25,56.75 30.5,56 30.5,52.75 32,51.25 38.75,51.25 38.75,35.25 41.75,32.25 48.25,32.25 59,21.5 59,9.5 57,7.5 54,7.5 47.5,1 14.25,1 5.5,9.75 5.5,23.75 8.75,27 18.75,27 20.25,25.5 20.25,24.5 19.25,24.5 19,24.75 18.5,24.75 17.65,25.6 10.85,25.6 7.75,22.5 7.75,10.7 16.45,2 29.5,2 30.5,3 30.5,4.25 37.75,4.25 41,7.5 41,14.25 47.25,20.5 47.25,30 46.25,31 43,31 42.85,31.15 40.25,31.15 38.05,33.35 33.6,33.35 32.5,32.25 32.5,28.25 34.75,26 39,26 39.25,25.75 39.25,24.75 39,24.5 33.5,24.5 31.25,26.75 31.25,36.25 35.5,40.5 35.5,42.75 36.75,44 36.75,46.25 37.05,46.55 37.05,49.15 36.2,50 31.5,50 28.75,52.75 24.5,52.75 22.75,51 22.75,46.5 24.5,44.75 28,44.75 28.75,44 29.5,44 29.5,43.75 22.25,43.75 21.25,44.75 21.25,55.75 23.75,58.25 49,58.25 50.75,60 50.75,60.75
RESET  (via drill 0.35)
  Top 0.152: v21.4,73.3 17.2,69.1 17.2,49.79 14.46,47.05 RESET.B RESET.A
  Top 1.27: U$10.74 U$10.30
  Bottom 0.152: v21.4,73.3 21.6,73.5 26,73.5 28.73,70.77 U$10.30
ROW0  (via drill 0.35)
  Top 0.152: SW2.SW1 26.19,14.41 v19.8,20.8
  Top 1.27: U$10.20 U$10.63
  Bottom 0.152: U$10.20 5.87,79.83 10.5,75.2 10.5,69.6 7.9,67 5.2,67 2.6,64.4 2.6,45.4 13.4,34.6 13.4,31.8 | v19.8,20.8 14.5,26.1 14,26.1 12.2,27.9 12.2,30.6 13.4,31.8 | 13.4,31.8 16.43,31.8 SW1.SW1
ROW1
  Top 1.27: U$10.19 U$10.62
  Bottom 0.152: U$10.19 8.4,79.7 10.6,77.5 14.4,77.5 22.4,69.5 22.4,59.1 26.19,55.31 SW3.SW1 23.44,50.54 22.5,49.6 22.5,43.7 34.66,31.54 SW4.SW1
SWCLK
  Top 1.27: U$10.41 U$10.84
SWDIO
  Top 1.27: U$10.43 U$10.86
VBUS
  Top 1.27: U$10.64 U$10.40

### Text on the board
tPlace: RESET
bPlace: Rev1.0.0
Document: FaBo Keyboard sample / Rev1.0.0 / 2023/5/31